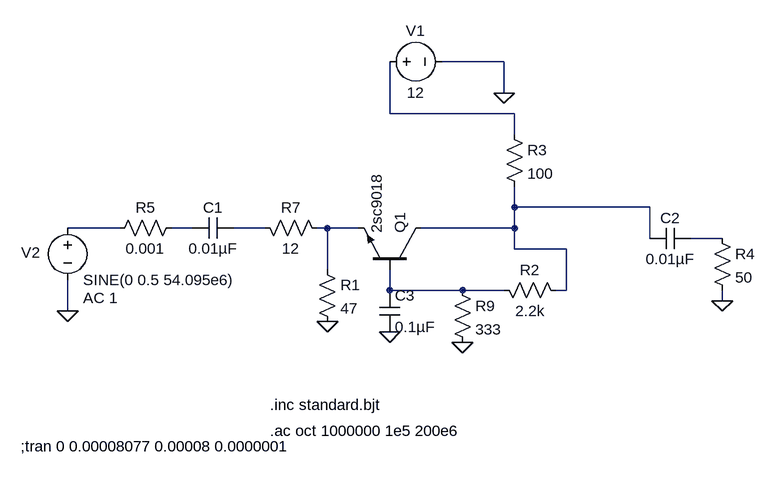
[diagram p0: schematic singl-BJT-amp-gain-common-base.asc]
singl-BJT-amp-gain-common-base.asc, the LTspice schematic file:
Version 4
SHEET 1 880 680
WIRE 368 -112 272 -112
WIRE 368 -64 368 -112
WIRE 192 -32 192 -112
WIRE 384 -32 192 -32
WIRE 384 0 384 -32
WIRE 384 112 384 80
WIRE 592 112 384 112
WIRE -224 144 -304 144
WIRE -112 144 -144 144
WIRE 0 144 -48 144
WIRE 96 144 80 144
WIRE 144 144 96 144
WIRE 384 144 384 112
WIRE 384 144 240 144
WIRE 592 160 592 112
WIRE 704 160 656 160
WIRE 384 176 384 144
WIRE 464 176 384 176
WIRE 96 208 96 144
WIRE 192 240 192 208
WIRE 304 240 192 240
WIRE 368 240 304 240
WIRE 464 240 464 176
WIRE 464 240 448 240
WIRE 704 256 704 240
WIRE -304 272 -304 224
FLAG 368 -64 0
FLAG -304 272 0
FLAG 96 288 0
FLAG 704 256 0
FLAG 192 304 0
FLAG 304 320 0
SYMBOL res 80 192 R0
SYMATTR InstName R1
SYMATTR Value 47
SYMATTR SpiceLine tol=1% pwr=1
SYMBOL npn 240 208 M270
SYMATTR InstName Q1
SYMATTR Value 2sc9018
SYMBOL voltage 176 -112 R270
WINDOW 0 32 56 VTop 2
WINDOW 3 -32 56 VBottom 2
WINDOW 123 0 0 Left 2
WINDOW 39 4 56 VTop 2
SYMATTR InstName V1
SYMATTR Value 12
SYMBOL voltage -304 128 R0
WINDOW 123 24 124 Left 2
WINDOW 39 0 0 Left 2
WINDOW 0 -71 54 Left 2
SYMATTR Value2 AC 1
SYMATTR InstName V2
SYMATTR Value SINE(0 0.5 54.095e6)
SYMBOL res 688 144 R0
SYMATTR InstName R4
SYMATTR Value 50
SYMATTR SpiceLine tol=1% pwr=1
SYMBOL res -240 160 R270
WINDOW 0 32 56 VTop 2
WINDOW 3 0 56 VBottom 2
SYMATTR InstName R5
SYMATTR Value 0.001
SYMATTR SpiceLine tol=1% pwr=1
SYMBOL cap -48 160 M270
WINDOW 0 32 32 VTop 2
WINDOW 3 0 32 VBottom 2
SYMATTR InstName C1
SYMATTR Value 0.01µF
SYMBOL res 368 -16 R0
SYMATTR InstName R3
SYMATTR Value 100
SYMBOL cap 592 144 M90
WINDOW 0 0 32 VBottom 2
WINDOW 3 32 32 VTop 2
SYMATTR InstName C2
SYMATTR Value 0.01µF
SYMBOL cap 176 240 R0
SYMATTR InstName C3
SYMATTR Value 0.1µF
SYMBOL res -16 128 M90
WINDOW 0 0 56 VBottom 2
WINDOW 3 32 56 VTop 2
SYMATTR InstName R7
SYMATTR Value 12
SYMBOL res 352 224 M90
WINDOW 0 0 56 VBottom 2
WINDOW 3 32 56 VTop 2
SYMATTR InstName R2
SYMATTR Value 2.2k
SYMBOL res 288 224 R0
SYMATTR InstName R9
SYMATTR Value 333
TEXT 8 416 Left 2 !.inc standard.bjt
TEXT 8 456 Left 2 !.ac oct 1000000 1e5 200e6
TEXT -376 480 Left 2 !;tran 0 0.00008077 0.00008 0.0000001

The netlist it stands for:
* singl-BJT-amp-gain-common-base.asc
R1 N006 0 47 tol=1% pwr=1
Q1 N002 N008 N006 0 2sc9018
V1 N001 0 12
V2 N003 0 SINE(0 0.5 54.095e6) AC 1
R4 N007 0 50 tol=1% pwr=1
R5 N003 N004 0.001 tol=1% pwr=1
C1 N005 N004 0.01µF
R3 N001 N002 100
C2 N002 N007 0.01µF
C3 N008 0 0.1µF
R7 N005 N006 12
R2 N008 N002 2.2k
R9 N008 0 333
.model NPN NPN
.model PNP PNP
.lib standard.bjt
.inc standard.bjt
.ac oct 1000000 1e5 200e6
;tran 0 0.00008077 0.00008 0.0000001
.backanno
.end